# Altium schematic sheet sesnor schematic.SchDoc
size A1; Organization: Altium Limited; Address1: L3, 12a Rodborough Rd; Address2: Frenchs Forest; Address3: NSW; Address4: Australia 2086
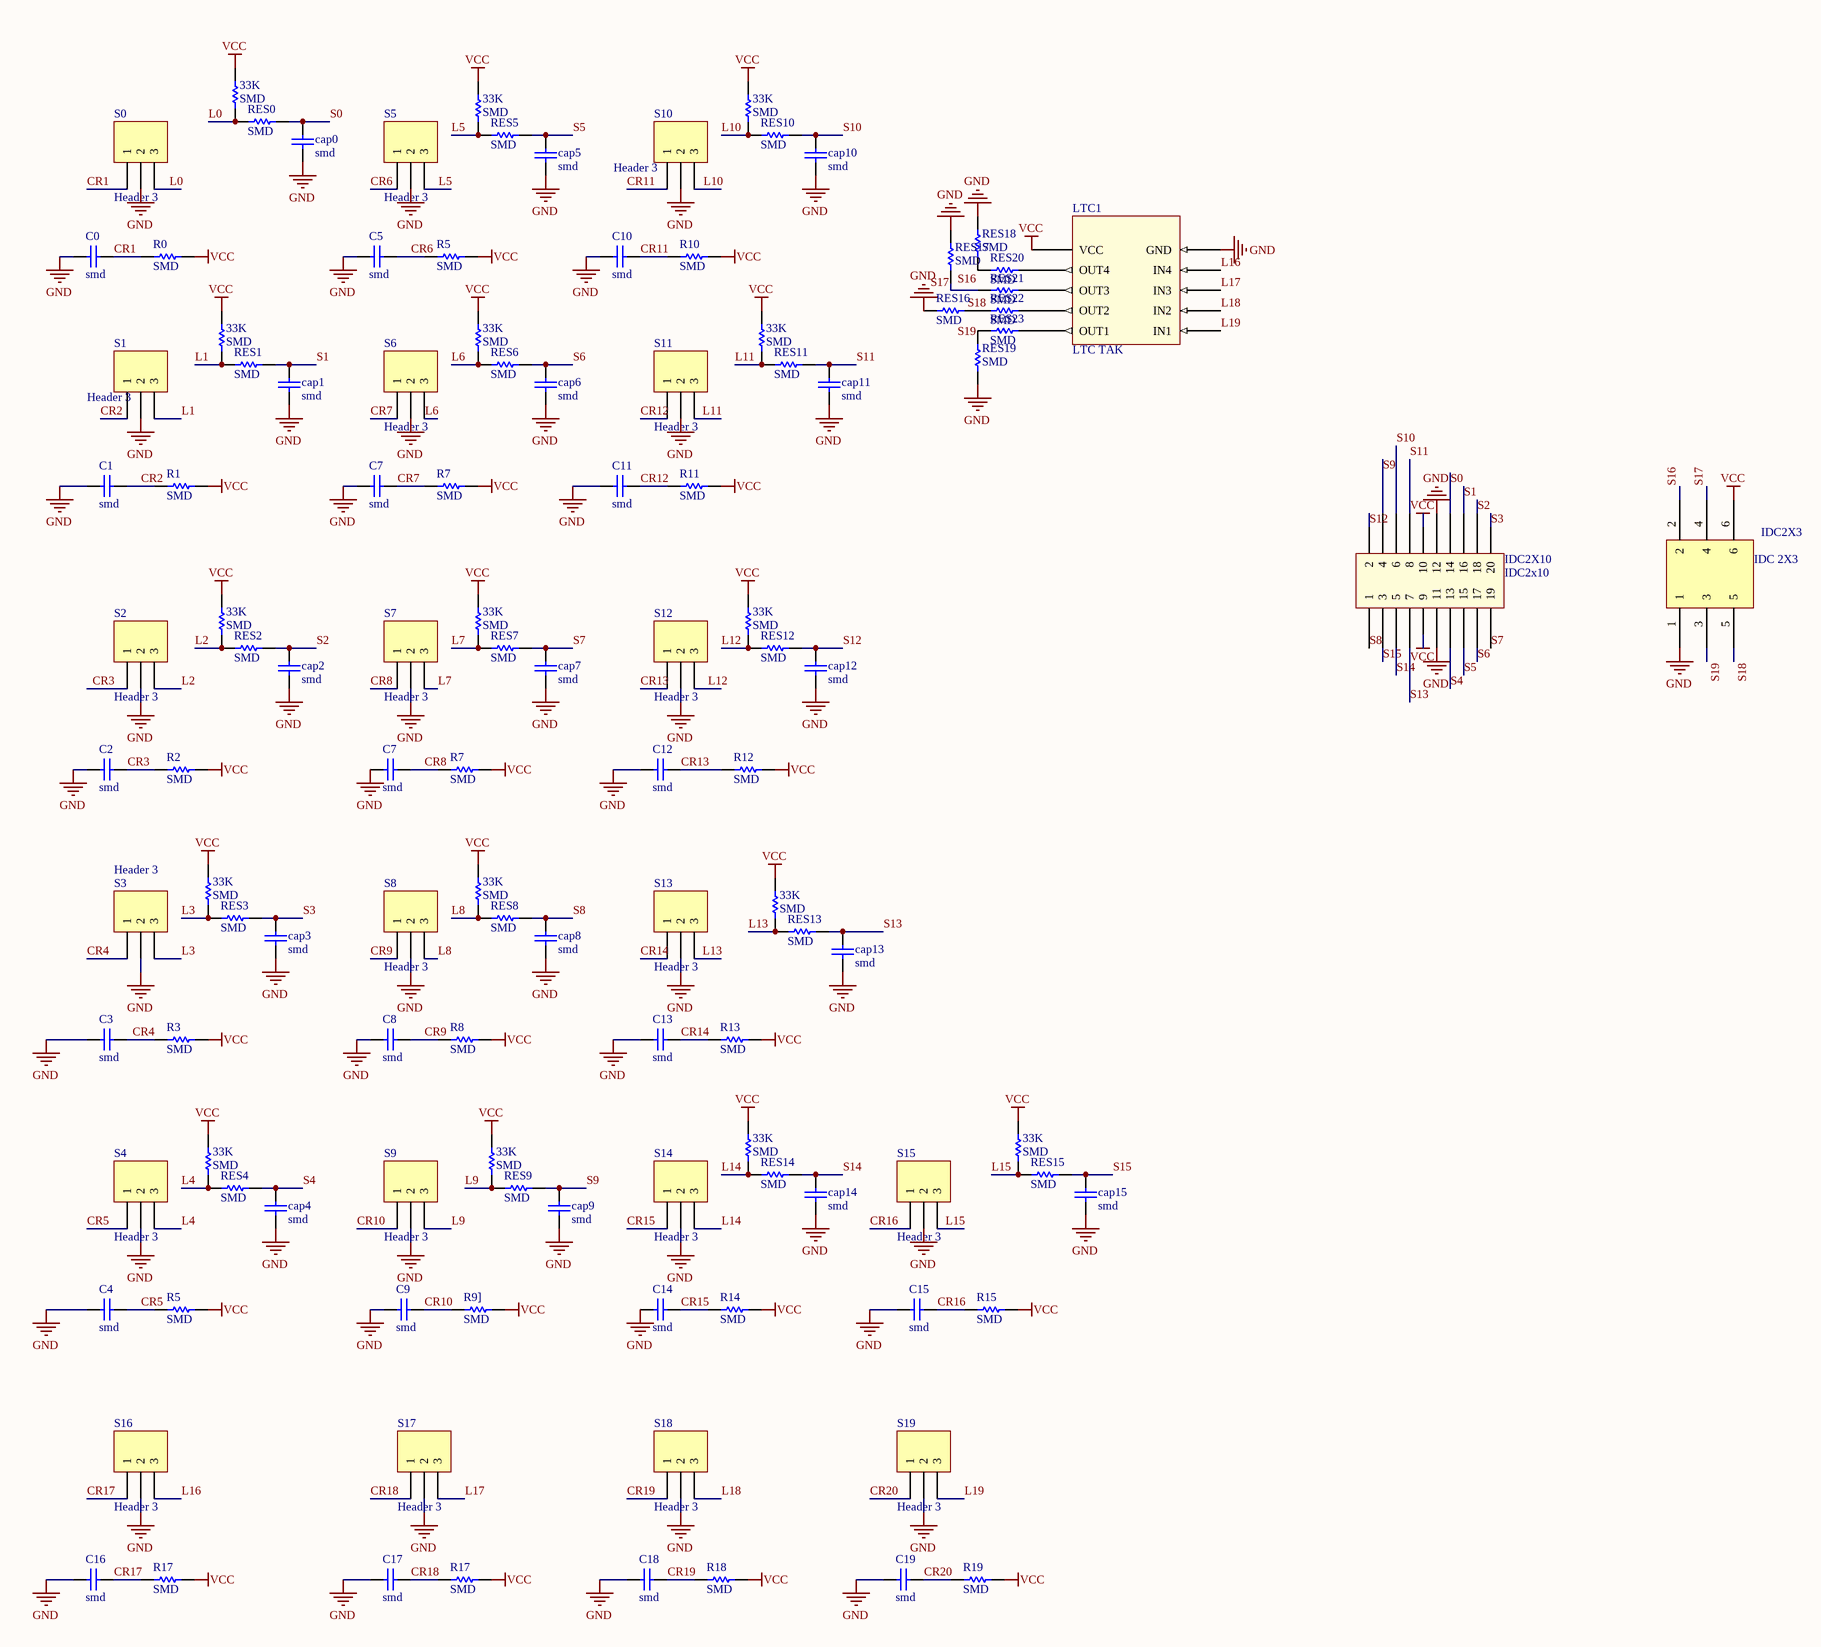
[diagram p0: sesnor schematic.SchDoc]

## Parts
(Parts that share a designator on the sheet are numbered #1, #2 ... from top to bottom, then left to right.)
33K#1  SMD  [Resistor SMD 1206]
33K#2  SMD  [Resistor SMD 1206]
33K#3  SMD  [Resistor SMD 1206]
33K#4  SMD  [Resistor SMD 1206]
33K#5  SMD  [Resistor SMD 1206]
33K#6  SMD  [Resistor SMD 1206]
33K#7  SMD  [Resistor SMD 1206]
33K#8  SMD  [Resistor SMD 1206]
33K#9  SMD  [Resistor SMD 1206]
33K#10  SMD  [Resistor SMD 1206]
33K#11  SMD  [Resistor SMD 1206]
33K#12  SMD  [Resistor SMD 1206]
33K#13  SMD  [Resistor SMD 1206]
33K#14  SMD  [Resistor SMD 1206]
33K#15  SMD  [Resistor SMD 1206]
33K#16  SMD  [Resistor SMD 1206]
C0  smd  [Cap SMD]
C1  smd  [Cap SMD]
C2  smd  [Cap SMD]
C3  smd  [Cap SMD]
C4  smd  [Cap SMD]
C5  smd  [Cap SMD]
C7#1  smd  [Cap SMD]
C7#2  smd  [Cap SMD]
C8  smd  [Cap SMD]
C9  smd  [Cap SMD]
C10  smd  [Cap SMD]
C11  smd  [Cap SMD]
C12  smd  [Cap SMD]
C13  smd  [Cap SMD]
C14  smd  [Cap SMD]
C15  smd  [Cap SMD]
C16  smd  [Cap SMD]
C17  smd  [Cap SMD]
C18  smd  [Cap SMD]
C19  smd  [Cap SMD]
cap0  smd  [Cap SMD]
cap1  smd  [Cap SMD]
cap2  smd  [Cap SMD]
cap3  smd  [Cap SMD]
cap4  smd  [Cap SMD]
cap5  smd  [Cap SMD]
cap6  smd  [Cap SMD]
cap7  smd  [Cap SMD]
cap8  smd  [Cap SMD]
cap9  smd  [Cap SMD]
cap10  smd  [Cap SMD]
cap11  smd  [Cap SMD]
cap12  smd  [Cap SMD]
cap13  smd  [Cap SMD]
cap14  smd  [Cap SMD]
cap15  smd  [Cap SMD]
IDC2X3  IDC 2X3  [IDC 2X3]
IDC2X10  IDC2x10  [IDC 2x10]
LTC1  LTC TAK  [LTC TAK]
R0  SMD  [Resistor SMD 1206]
R1  SMD  [Resistor SMD 1206]
R2  SMD  [Resistor SMD 1206]
R3  SMD  [Resistor SMD 1206]
R5#1  SMD  [Resistor SMD 1206]
R5#2  SMD  [Resistor SMD 1206]
R7#1  SMD  [Resistor SMD 1206]
R7#2  SMD  [Resistor SMD 1206]
R8  SMD  [Resistor SMD 1206]
R9]  SMD  [Resistor SMD 1206]
R10  SMD  [Resistor SMD 1206]
R11  SMD  [Resistor SMD 1206]
R12  SMD  [Resistor SMD 1206]
R13  SMD  [Resistor SMD 1206]
R14  SMD  [Resistor SMD 1206]
R15  SMD  [Resistor SMD 1206]
R17#1  SMD  [Resistor SMD 1206]
R17#2  SMD  [Resistor SMD 1206]
R18  SMD  [Resistor SMD 1206]
R19  SMD  [Resistor SMD 1206]
RES0  SMD  [Resistor SMD 1206]
RES1  SMD  [Resistor SMD 1206]
RES2  SMD  [Resistor SMD 1206]
RES3  SMD  [Resistor SMD 1206]
RES4  SMD  [Resistor SMD 1206]
RES5  SMD  [Resistor SMD 1206]
RES6  SMD  [Resistor SMD 1206]
RES7  SMD  [Resistor SMD 1206]
RES8  SMD  [Resistor SMD 1206]
RES9  SMD  [Resistor SMD 1206]
RES10  SMD  [Resistor SMD 1206]
RES11  SMD  [Resistor SMD 1206]
RES12  SMD  [Resistor SMD 1206]
RES13  SMD  [Resistor SMD 1206]
RES14  SMD  [Resistor SMD 1206]
RES15  SMD  [Resistor SMD 1206]
RES16  SMD  [Resistor SMD 1206]
RES17  SMD  [Resistor SMD 1206]
RES18  SMD  [Resistor SMD 1206]
RES19  SMD  [Resistor SMD 1206]
RES20  SMD  [Resistor SMD 1206]
RES21  SMD  [Resistor SMD 1206]
RES22  SMD  [Resistor SMD 1206]
RES23  SMD  [Resistor SMD 1206]
S0  Header 3  [HDR1X3]
S1  Header 3  [HDR1X3]
S2  Header 3  [HDR1X3]
S3  Header 3  [HDR1X3]
S4  Header 3  [HDR1X3]
S5  Header 3  [HDR1X3]
S6  Header 3  [HDR1X3]
S7  Header 3  [HDR1X3]
S8  Header 3  [HDR1X3]
S9  Header 3  [HDR1X3]
S10  Header 3  [HDR1X3]
S11  Header 3  [HDR1X3]
S12  Header 3  [HDR1X3]
S13  Header 3  [HDR1X3]
S14  Header 3  [HDR1X3]
S15  Header 3  [HDR1X3]
S16  Header 3  [HDR1X3]
S17  Header 3  [HDR1X3]
S18  Header 3  [HDR1X3]
S19  Header 3  [HDR1X3]

## Nets
GND: C0.1 C1.1 C2.1 C3.1 C4.1 C5.1 C7#1.1 C7#2.1 C8.1 C9.1 C10.1 C11.1 C12.1 C13.1 C14.1 C15.1 C16.1 C17.1 C18.1 C19.1 cap0.1 cap1.1 cap2.1 cap3.1 cap4.1 cap5.1 cap6.1 cap7.1 cap8.1 cap9.1 cap10.1 cap11.1 cap12.1 cap13.1 cap14.1 cap15.1 IDC2X3.1 IDC2X10.11 IDC2X10.12 LTC1.10(GND) RES16.1 RES17.2 RES18.2 RES19.1 S0.2 S1.2 S2.2 S3.2 S4.2 S5.2 S6.2 S7.2 S8.2 S9.2 S10.2 S11.2 S12.2 S13.2 S14.2 S15.2 S16.2 S17.2 S18.2 S19.2
VCC: 33K#1.1 33K#2.1 33K#3.1 33K#4.1 33K#5.1 33K#6.1 33K#7.1 33K#8.1 33K#9.1 33K#10.1 33K#11.1 33K#12.1 33K#13.1 33K#14.1 33K#15.1 33K#16.1 IDC2X3.6 IDC2X10.9 IDC2X10.10 LTC1.1(VCC) R0.2 R1.2 R2.2 R3.2 R5#1.2 R5#2.2 R7#1.2 R7#2.2 R8.2 R9].2 R10.2 R11.2 R12.2 R13.2 R14.2 R15.2 R17#1.2 R17#2.2 R18.2 R19.2
CR1: C0.2 R0.1 S0.1
CR2: C1.2 R1.1 S1.1
CR3: C2.2 R2.1 S2.1
CR4: C3.2 R3.1 S3.1
CR5: C4.2 R5#2.1 S4.1
CR6: C5.2 R5#1.1 S5.1
CR7: C7#1.2 R7#1.1 S6.1
CR8: C7#2.2 R7#2.1 S7.1
CR9: C8.2 R8.1 S8.1
CR10: C9.2 R9].1 S9.1
CR11: C10.2 R10.1 S10.1
CR12: C11.2 R11.1 S11.1
CR13: C12.2 R12.1 S12.1
CR14: C13.2 R13.1 S13.1
CR15: C14.2 R14.1 S14.1
CR16: C15.2 R15.1 S15.1
CR17: C16.2 R17#1.1 S16.1
CR18: C17.2 R17#2.1 S17.1
CR19: C18.2 R18.1 S18.1
CR20: C19.2 R19.1 S19.1
L0: 33K#1.2 RES0.1 S0.3
L1: 33K#4.2 RES1.1 S1.3
L2: 33K#7.2 RES2.1 S2.3
L3: 33K#10.2 RES3.1 S3.3
L4: 33K#15.2 RES4.1 S4.3
L5: 33K#2.2 RES5.1 S5.3
L6: 33K#5.2 RES6.1 S6.3
L7: 33K#8.2 RES7.1 S7.3
L8: 33K#11.2 RES8.1 S8.3
L9: 33K#16.2 RES9.1 S9.3
L10: 33K#3.2 RES10.1 S10.3
L11: 33K#6.2 RES11.1 S11.3
L12: 33K#9.2 RES12.1 S12.3
L13: 33K#12.2 RES13.1 S13.3
L14: 33K#13.2 RES14.1 S14.3
L15: 33K#14.2 RES15.1 S15.3
L16: LTC1.9(IN4) S16.3
L17: LTC1.8(IN3) S17.3
L18: LTC1.7(IN2) S18.3
L19: LTC1.6(IN1) S19.3
S0: cap0.2 IDC2X10.14 RES0.2
S1: cap1.2 IDC2X10.16 RES1.2
S2: cap2.2 IDC2X10.18 RES2.2
S3: cap3.2 IDC2X10.20 RES3.2
S4: cap4.2 IDC2X10.13 RES4.2
S5: cap5.2 IDC2X10.15 RES5.2
S6: cap6.2 IDC2X10.17 RES6.2
S7: cap7.2 IDC2X10.19 RES7.2
S8: cap8.2 IDC2X10.1 RES8.2
S9: cap9.2 IDC2X10.4 RES9.2
S10: cap10.2 IDC2X10.6 RES10.2
S11: cap11.2 IDC2X10.8 RES11.2
S12: cap12.2 IDC2X10.2 RES12.2
S13: cap13.2 IDC2X10.7 RES13.2
S14: cap14.2 IDC2X10.5 RES14.2
S15: cap15.2 IDC2X10.3 RES15.2
S16: IDC2X3.2 RES18.1 RES20.1
S17: IDC2X3.4 RES17.1 RES21.1
S18: IDC2X3.5 RES16.2 RES22.1
S19: IDC2X3.3 RES19.2 RES23.1
NetLTC1_2: LTC1.2(OUT4) RES20.2
NetLTC1_3: LTC1.3(OUT3) RES21.2
NetLTC1_4: LTC1.4(OUT2) RES22.2
NetLTC1_5: LTC1.5(OUT1) RES23.2

## Notes on the sheet
- Title
- Size:
- Date:
- File:
- A1
- Number:
- Time:
- Revision:
- Sheet
- of

## Library data of the parts
33K#1-33K#16 R0-R3 R5#1 R5#2 R7#1 R7#2 R8 R9] R10-R15 R17#1 R17#2 R18 R19 RES0-RES23 = Res SMD
C0-C5 C7#1 C7#2 C8-C19 cap0-cap15 = Cap SMD
IDC2X10 = IDC 2x10
S0-S19 = Header 3: Header, 3-Pin; LatestRevisionDate: 17-Jul-2002; LatestRevisionNote: Re-released for DXP Platform.; Publisher: Altium Limited